# Altium schematic sheet connect.SchDoc
size A4; SheetNumber: 2; SheetTotal: 3
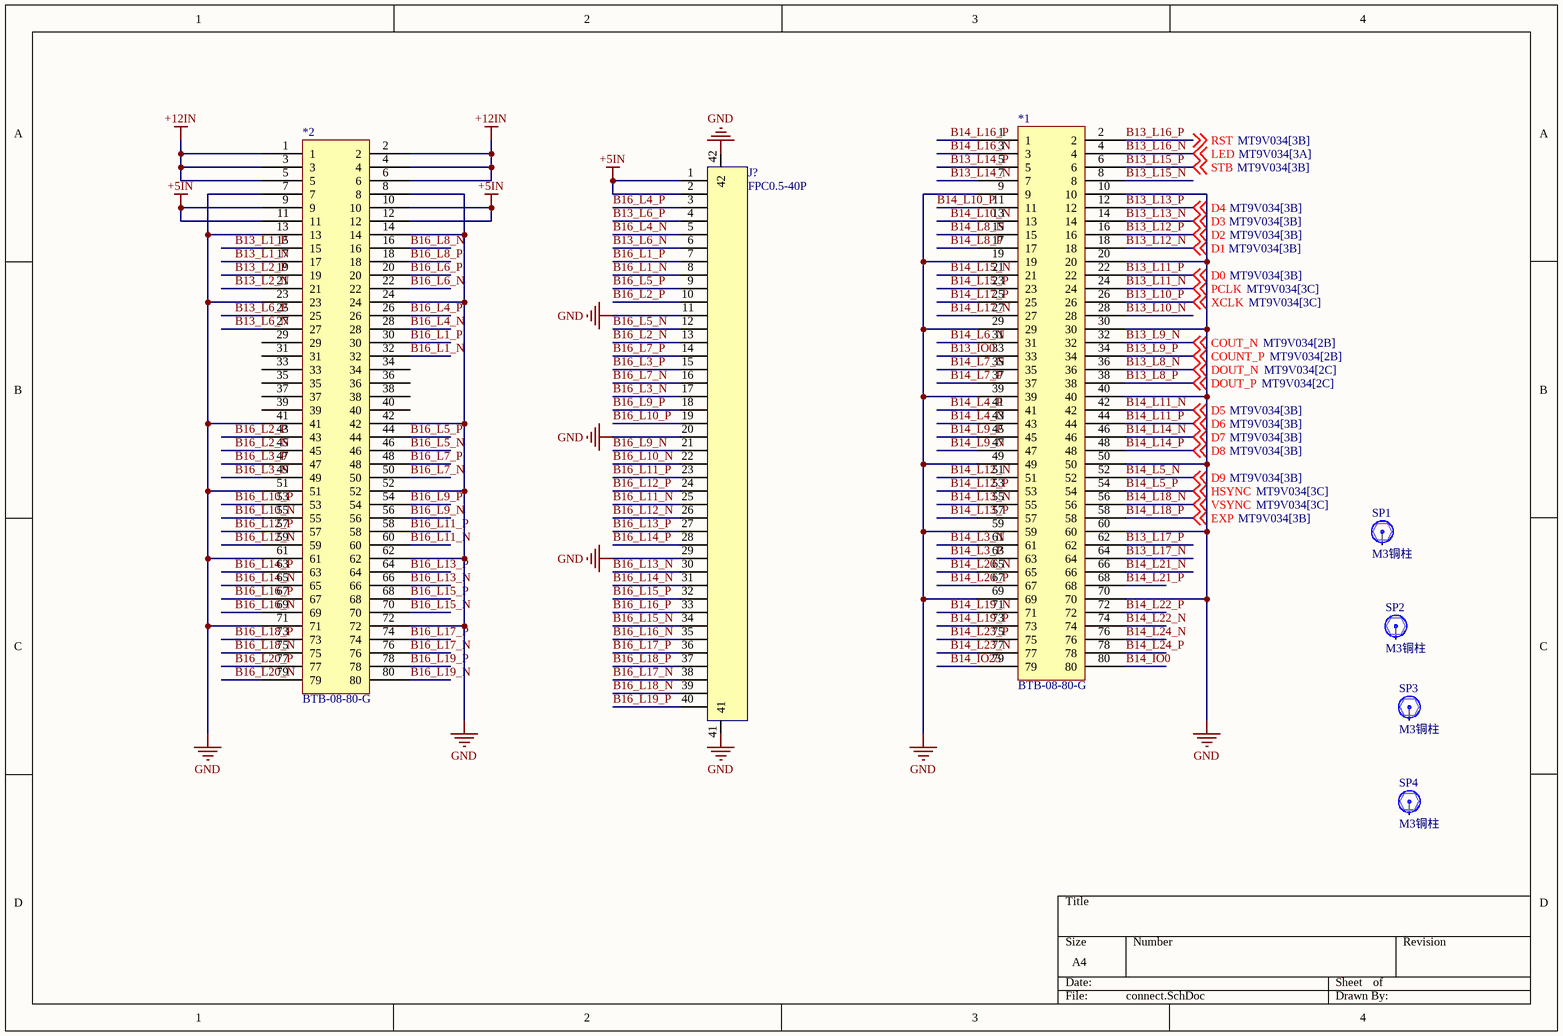
[diagram p0: connect.SchDoc]

## Parts
*1  BTB-08-80-G  [BTB-08-80-G]
*2  BTB-08-80-G  [BTB-08-80-G]
J?  FPC0.5-40P  [FPC0.5-40P]
SP1  M3铜柱  [M3x5_N]
SP2  M3铜柱  [M3x5_N]
SP3  M3铜柱  [M3x5_N]
SP4  M3铜柱  [M3x5_N]

## Nets
+5IN: *2.9 *2.10 *2.11 *2.12 J?.1 J?.2
+12IN: *2.1 *2.2 *2.3 *2.4 *2.5 *2.6
GND: *1.9 *1.10 *1.19 *1.20 *1.29 *1.30 *1.39 *1.40 *1.49 *1.50 *1.59 *1.60 *1.69 *1.70 *2.7 *2.8 *2.13 *2.14 *2.23 *2.24 *2.41 *2.42 *2.51 *2.52 *2.61 *2.62 *2.71 *2.72 J?.11 J?.20 J?.29 J?.41 J?.42
B13_IO0: *1.33
B13_L1_N: *2.17
B13_L1_P: *2.15
B13_L2_N: *2.21
B13_L2_P: *2.19
B13_L6_N: *2.27 J?.6
B13_L6_P: *2.25 J?.4
B13_L8_N: *1.36 ; off-sheet DOUT_N  [also labelled DOUT_N]
B13_L8_P: *1.38 ; off-sheet DOUT_P  [also labelled DOUT_P]
B13_L9_N: *1.32 ; off-sheet COUT_N  [also labelled COUT_N]
B13_L9_P: *1.34 ; off-sheet COUNT_P  [also labelled COUNT_P]
B13_L10_N: *1.28
B13_L10_P: *1.26 ; off-sheet XCLK  [also labelled XCLK]
B13_L11_N: *1.24 ; off-sheet PCLK  [also labelled PCLK]
B13_L11_P: *1.22 ; off-sheet D0  [also labelled D0]
B13_L12_N: *1.18 ; off-sheet D1  [also labelled D1]
B13_L12_P: *1.16 ; off-sheet D2  [also labelled D2]
B13_L13_N: *1.14 ; off-sheet D3  [also labelled D3]
B13_L13_P: *1.12 ; off-sheet D4  [also labelled D4]
B13_L14_N: *1.7
B13_L14_P: *1.5
B13_L15_N: *1.8
B13_L15_P: *1.6 ; off-sheet STB  [also labelled STB]
B13_L16_N: *1.4 ; off-sheet LED  [also labelled LED]
B13_L16_P: *1.2 ; off-sheet RST  [also labelled RST]
B13_L17_N: *1.64
B13_L17_P: *1.62
B14_IO0: *1.80
B14_IO25: *1.79
B14_L3_N: *1.61
B14_L3_P: *1.63
B14_L4_N: *1.43
B14_L4_P: *1.41
B14_L5_N: *1.52 ; off-sheet D9  [also labelled D9]
B14_L5_P: *1.54 ; off-sheet HSYNC  [also labelled HSYNC]
B14_L6_N: *1.31
B14_L7_N: *1.35
B14_L7_P: *1.37
B14_L8_N: *1.15
B14_L8_P: *1.17
B14_L9_N: *1.47
B14_L9_P: *1.45
B14_L10_N: *1.13
B14_L10_P: *1.11
B14_L11_N: *1.42 ; off-sheet D5  [also labelled D5]
B14_L11_P: *1.44 ; off-sheet D6  [also labelled D6]
B14_L12_N: *1.51
B14_L12_P: *1.53
B14_L13_N: *1.55
B14_L13_P: *1.57
B14_L14_N: *1.46 ; off-sheet D7  [also labelled D7]
B14_L14_P: *1.48 ; off-sheet D8  [also labelled D8]
B14_L15_N: *1.21
B14_L15_P: *1.23
B14_L16_N: *1.3
B14_L16_P: *1.1
B14_L17_N: *1.27
B14_L17_P: *1.25
B14_L18_N: *1.56 ; off-sheet VSYNC  [also labelled VSYNC]
B14_L18_P: *1.58 ; off-sheet EXP  [also labelled EXP]
B14_L19_N: *1.71
B14_L19_P: *1.73
B14_L20_N: *1.65
B14_L20_P: *1.67
B14_L21_N: *1.66
B14_L21_P: *1.68
B14_L22_N: *1.74
B14_L22_P: *1.72
B14_L23_N: *1.77
B14_L23_P: *1.75
B14_L24_N: *1.76
B14_L24_P: *1.78
B16_L1_N: *2.32 J?.8
B16_L1_P: *2.30 J?.7
B16_L2_N: *2.45 J?.13
B16_L2_P: *2.43 J?.10
B16_L3_N: *2.49 J?.17
B16_L3_P: *2.47 J?.15
B16_L4_N: *2.28 J?.5
B16_L4_P: *2.26 J?.3
B16_L5_N: *2.46 J?.12
B16_L5_P: *2.44 J?.9
B16_L6_N: *2.22
B16_L6_P: *2.20
B16_L7_N: *2.50 J?.16
B16_L7_P: *2.48 J?.14
B16_L8_N: *2.16
B16_L8_P: *2.18
B16_L9_N: *2.56 J?.21
B16_L9_P: *2.54 J?.18
B16_L10_N: *2.55 J?.22
B16_L10_P: *2.53 J?.19
B16_L11_N: *2.60 J?.25
B16_L11_P: *2.58 J?.23
B16_L12_N: *2.59 J?.26
B16_L12_P: *2.57 J?.24
B16_L13_N: *2.66 J?.30
B16_L13_P: *2.64 J?.27
B16_L14_N: *2.65 J?.31
B16_L14_P: *2.63 J?.28
B16_L15_N: *2.70 J?.34
B16_L15_P: *2.68 J?.32
B16_L16_N: *2.69 J?.35
B16_L16_P: *2.67 J?.33
B16_L17_N: *2.76 J?.38
B16_L17_P: *2.74 J?.36
B16_L18_N: *2.75 J?.39
B16_L18_P: *2.73 J?.37
B16_L19_N: *2.80
B16_L19_P: *2.78 J?.40
B16_L20_N: *2.79
B16_L20_P: *2.77

Not connected (* = marked no-connect by the designer): *2 29 31 33 34 35 36 37 38 39 40; SP1 1; SP2 1; SP3 1; SP4 1

## Library data of the parts
J? = FPC0.5-40P: 贴片
SP1-SP4 = 铜柱大焊盘: 铜柱; 版权归属: 封装库来自淘宝 ID：黄晶宝石; BOM名称: 铜柱; 学习资源: https://shop463601444.taobao.com